# Altium schematic sheet PowerSupply.SchDoc
size 330 x 254 mm; Author: David Arancibia González; CompanyName: Universidad de Santiago de Chile; Address1: Avenida Ecuador Nº 3519; Address2: Estación Central, Santiago; Address3: Chile; DocumentNumber: 2; SheetNumber: 2; SheetTotal: 3
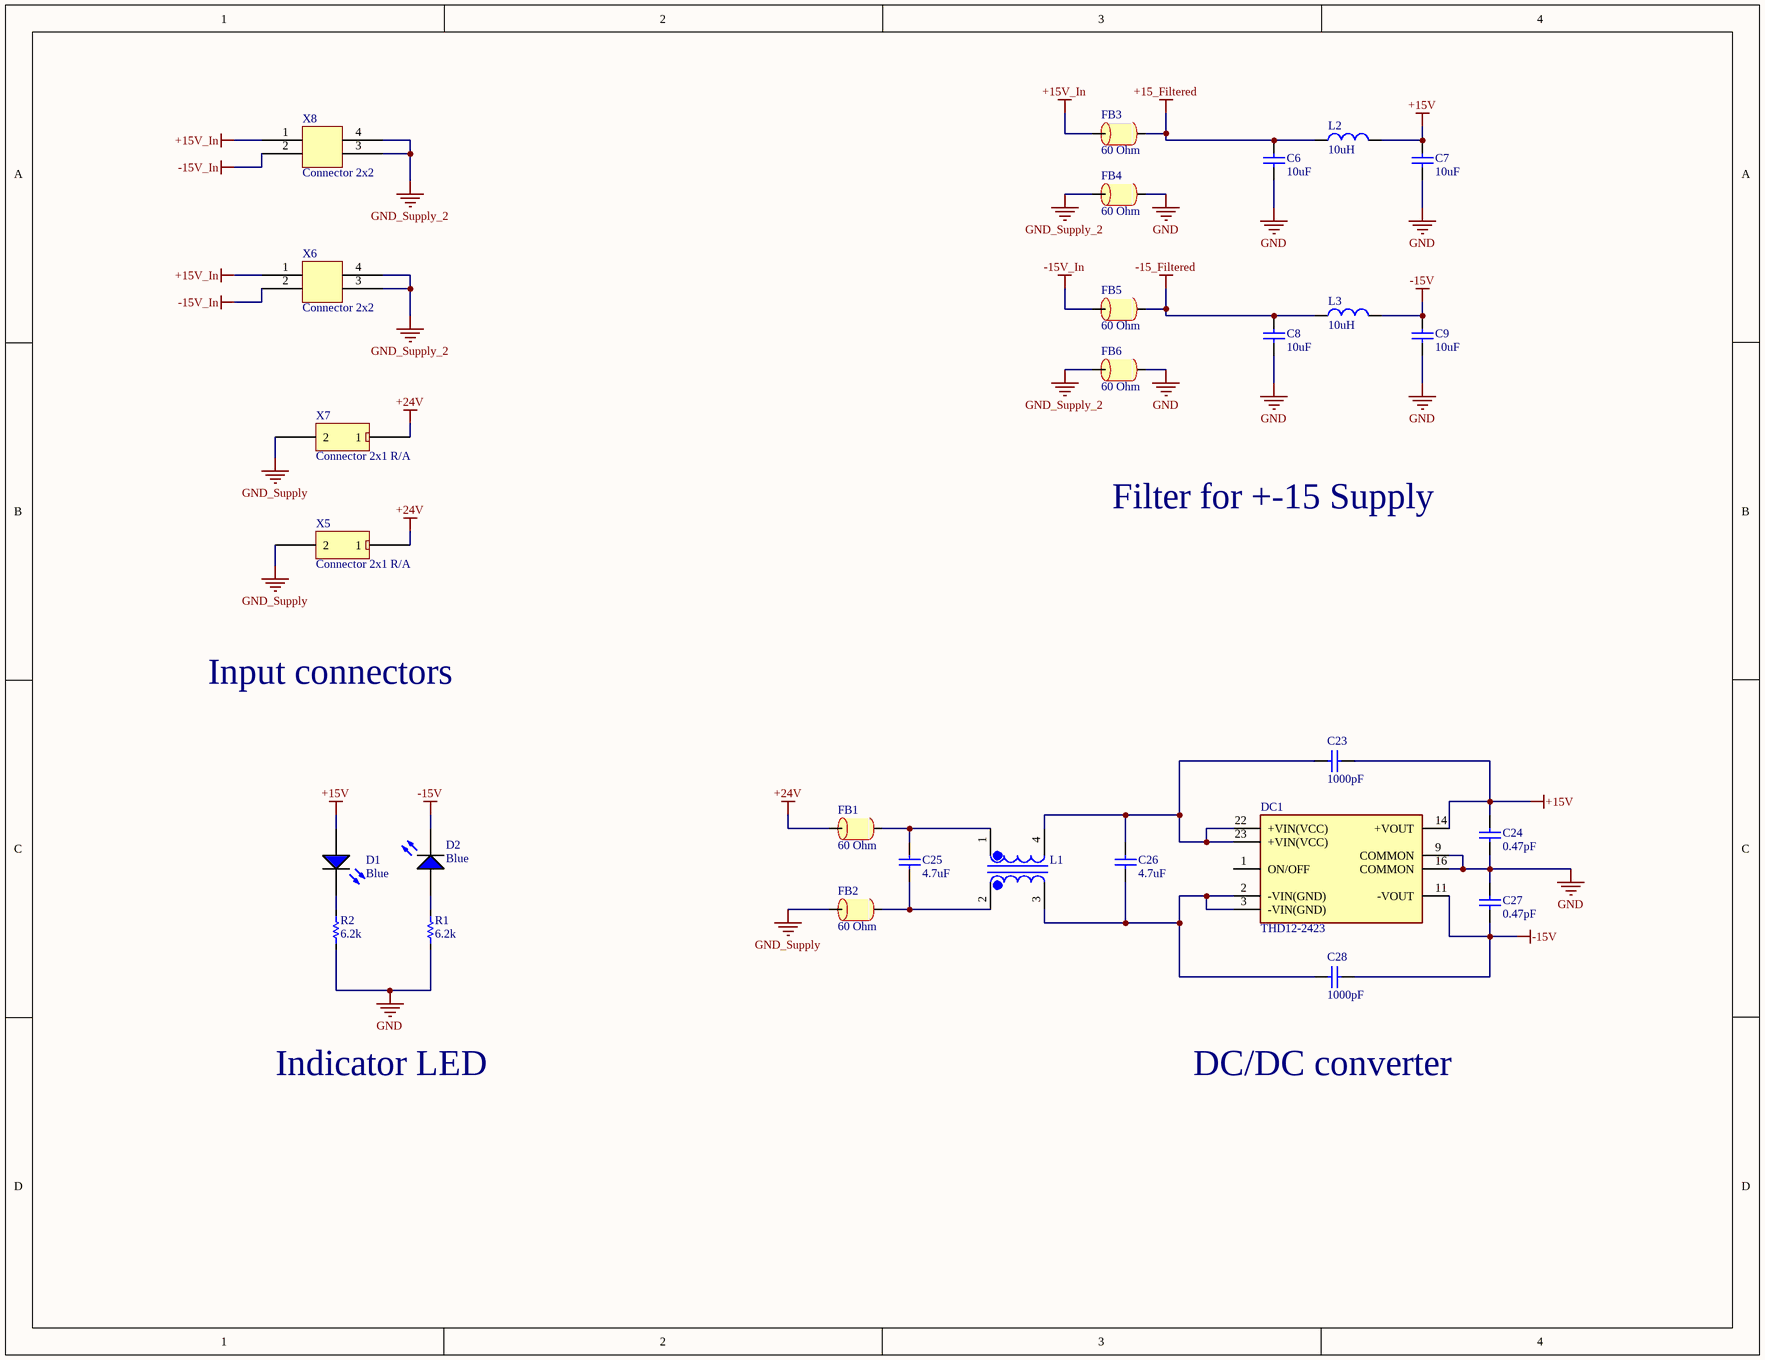
[diagram p0: PowerSupply.SchDoc]

## Parts
C6  10uF  [CAP_1210]
C7  10uF  [CAP_1210]
C8  10uF  [CAP_1210]
C9  10uF  [CAP_1210]
C23  1000pF  [CAP_1206]
C24  0.47pF  [CAP_0603]
C25  4.7uF  [CAP_1206]
C26  4.7uF  [CAP_1206]
C27  0.47pF  [CAP_0603]
C28  1000pF  [CAP_1206]
D1  Blue  [LED_0603_Blue]
D2  Blue  [LED_0603_Blue]
DC1  THD12-2423  [THD 12-2423]
FB1  60 Ohm  [FB_1206]
FB2  60 Ohm  [FB_1206]
FB3  60 Ohm  [FB_1206]
FB4  60 Ohm  [FB_1206]
FB5  60 Ohm  [FB_1206]
FB6  60 Ohm  [FB_1206]
L1  SC-07-04GJ  [SC-07-04GJ]  (value not drawn)
L2  10uH  [INDUCTOR_1210]
L3  10uH  [INDUCTOR_1210]
R1  6.2k  [RES_0603]
R2  6.2k  [RES_0603]
X5  Connector 2x1 R/A  [CON_WR-MPC4-649002227222]
X6  Connector 2x2  [0874270402]
X7  Connector 2x1 R/A  [CON_WR-MPC4-649002227222]
X8  Connector 2x2  [0874270402]

## Nets
+15_Filtered: C6.1 FB3.2 L2.1
+15V: C7.1 C23.2 C24.1 D1.1(A) DC1.14(+VOUT) L2.2
+15V_In: FB3.1 X6.1 X8.1
+24V: FB1.1 X5.1 X7.1
-15_Filtered: C8.1 FB5.2 L3.1
-15V: C9.1 C27.2 C28.2 D2.2(K) DC1.11(-VOUT) L3.2
-15V_In: FB5.1 X6.2 X8.2
GND: C6.2 C7.2 C8.2 C9.2 C24.2 C27.1 DC1.9(COMMON) DC1.16(COMMON) FB4.2 FB6.2 R1.1 R2.1
GND_Supply: FB2.1 X5.2 X7.2
GND_Supply_2: FB4.1 FB6.1 X6.3 X6.4 X8.3 X8.4
NetC23_1: C23.1 C26.1 DC1.22(+VIN(VCC)) DC1.23(+VIN(VCC)) L1.4
NetC25_1: C25.1 FB1.2 L1.1
NetC25_2: C25.2 FB2.2 L1.2
NetC26_2: C26.2 C28.1 DC1.2(-VIN(GND)) DC1.3(-VIN(GND)) L1.3
NetD1_2: D1.2(K) R2.2
NetD2_1: D2.1(A) R1.2

Not connected (* = marked no-connect by the designer): DC1 1(ON/OFF)

## Notes on the sheet
- Filter for +-15 Supply
- Input connectors
- Indicator LED
- DC/DC converter
- Title
- Size:
- Date:
- A4
- Revision:
- Time:
- Sheet
- of
- Author:
- Project:

## Library data of the parts
C6-C9 = Cap_1210: 10µF ±10% 50V Ceramic Capacitor X7R 1210 (3225 Metric); MF: KEMET; MFP: C1210C106K5RACTU; Created: 2020_06_15_DAarancibia; Package: 1210; Value: 10uF; Supplier 1: Digi-Key; Supplier Part Number 1: 399-11629-1-ND
C23 C28 = C1206C102KGRACAUTO: Cap Ceramic 0.001uF 2000V X7R 10% SMD 1206 125°C Embossed Plastic T/R; Manufacturer: KEMET; Voltage Rating: 2kV; Capacitance: 1nF; Supplier 1: Digi-Key; Supplier Part Number 1: 399-12976-1-ND; Manufacturer Part Number: C1206C102KGRACAUTO; RoHS: No; Category: Ceramic Capacitors; Stock 1: 904; Pricing 1: 1=0,27000, 10=0,18500, 50=0,12360, 100=0,10510, 500=0,07418, 1000=0,06491 (USD); Mount: Surface Mount; Case/Package: 1206; Case Code (Metric): 3216; Case Code (Imperial): 1206; Contact Plating: Tin,Matte; Dielectric Material: Ceramic; Min Operating Temperature: -55°C; Max Operating Temperature: 125°C; Tolerance: 10%; Packaging: Tape and Reel; Dielectric: X7R; Termination: SMD/SMT; Voltage Rating (DC): 2kV; Series: C; Construction: Flat; Length: 0.126inch; Width: 0.063inch; Thickness: 0.069inch; Ratings: AEC-Q200; REACH SVHC: No SVHC; RoHS Compliant: No; ComponentLink1URL: http://www.farnell.com/datasheets/2741171.pdf?src-supplier=Farnell; ComponentLink1Description: http://www.farnell.com/datasheets/2741171.pdf?src-supplier=Farnell; ComponentLink2URL: http://www.mouser.com/ds/2/212/KEM_C1010_X7R_HV_SMD-1102742.pdf?src-supplier=Mouser; ComponentLink2Description: http://www.mouser.com/ds/2/212/KEM_C1010_X7R_HV_SMD-1102742.pdf?src-supplier=Mouser; ComponentLink3URL: http://capacitoredge.kemet.com/capedge2/DataSheet/Datasheet-C1206C102KGRACAUTO.pdf?pn=C1206C102KGRACAUTO&src-supplier=Avnet; ComponentLink3Description: http://capacitoredge.kemet.com/capedge2/DataSheet/Datasheet-C1206C102KGRACAUTO.pdf?pn=C1206C102KGRACAUTO&src-supplier=Avnet; ComponentLink4URL: http://www.farnell.com/datasheets/2741171.pdf?src-supplier=Element14; ComponentLink4Description: http://www.farnell.com/datasheets/2741171.pdf?src-supplier=Element14; ComponentLink5URL: https://api.kemet.com/component-edge/download/datasheet/C1206C102KGRACAUTO.pdf?src-supplier=Digi-Key; ComponentLink5Description: https://api.kemet.com/component-edge/download/datasheet/C1206C102KGRACAUTO.pdf?src-supplier=Digi-Key; ComponentLink6URL: http://www.farnell.com/datasheets/2741171.pdf?src-supplier=Newark; ComponentLink6Description: http://www.farnell.com/datasheets/2741171.pdf?src-supplier=Newark
C24 C27 = CC0603CRNPO9BNR47: Surface Mount Ceramic Multilayer Capacitor 0.47pF 0.25pF C0G 50V 0603 Paper T/R; Manufacturer: Yageo; Insulation Resistance: 100GR; Supplier 1: Digi-Key; Supplier Part Number 1: 13-CC0603CRNPO9BNR47CT-ND; Manufacturer Part Number: CC0603CRNPO9BNR47; RoHS: Yes; Category: Ceramic Capacitors; Stock 1: 832; Pricing 1: 1=0,10000, 10=0,05600, 50=0,03040, 100=0,02480, 500=0,01774, 1000=0,01395 (USD); Mount: Surface Mount; Case/Package: 0603; Case Code (Imperial): 0603; Case Code (Metric): 1608; Dielectric Material: Ceramic; Min Operating Temperature: -55°C; Max Operating Temperature: 125°C; Capacitance: 0.47pF; Dielectric: C0G; Package Quantity: 4000; Packaging: Tape and Reel; Voltage Rating: 50V; Voltage Rating (DC): 50V; Termination: SMD/SMT; Resistor Type: Ceramic; Series: CC; Length: 1.6mm; Width: 0.031inch; Height: 0.8mm; Thickness: 0.035inch; Depth: 0.8mm; REACH SVHC: Unknown; Lead Free: Lead Free; RoHS Compliant: Yes; ComponentLink1URL: https://datasheet.ciiva.com/11586/upy-gp-np0-16v-to-50v-8-11586447.pdf?src-supplier=Avnet; ComponentLink1Description: https://datasheet.ciiva.com/11586/upy-gp-np0-16v-to-50v-8-11586447.pdf?src-supplier=Avnet; ComponentLink2URL: https://datasheet.ciiva.com/8033/1443161-8033695.pdf?src-supplier=Element14; ComponentLink2Description: https://datasheet.ciiva.com/8033/1443161-8033695.pdf?src-supplier=Element14; ComponentLink3URL: https://datasheet.ciiva.com/17437/upy-gp-np0-16v-to-50v-8-17437099.pdf?src-supplier=Avnet+Europe; ComponentLink3Description: https://datasheet.ciiva.com/17437/upy-gp-np0-16v-to-50v-8-17437099.pdf?src-supplier=Avnet+Europe
C25 C26 = UMK316ABJ475MLHT: Cap Ceramic 4.7uF 50V X5R 20% Pad SMD 1206 85C Low ESR Automotive T/R; Manufacturer: Taiyo Yuden; Supplier 1: Digi-Key; Supplier Part Number 1: 587-6377-1-ND; Manufacturer Part Number: UMK316ABJ475MLHT; RoHS: Yes; Category: Ceramic Capacitors; Stock 1: 157; Pricing 1: 1=0,41000, 10=0,28400, 50=0,19880, 100=0,17040, 500=0,12782, 1000=0,10794 (USD); Mount: Surface Mount; Case/Package: 1206; Min Operating Temperature: -55°C; Max Operating Temperature: 85°C; Packaging: Tape and Reel; Capacitance: 4.7uF; Tolerance: 20%; Voltage Rating: 50V; Ratings: AEC-Q200; RoHS Compliant: Yes; ComponentLink1URL: https://www.yuden.co.jp/productdata/catalog/mlcc_all_hq_e.pdf?src-supplier=Digi-Key; ComponentLink1Description: https://www.yuden.co.jp/productdata/catalog/mlcc_all_hq_e.pdf?src-supplier=Digi-Key
D1 D2 = Led_0603_Blue: Blue 470nm LED Indication - Discrete 3.2V 0603 (1608 Metric); MF: Würth Elektronik; MFP: 150060BS75000; Created: 2020_07_06_DAarancibia; Package: 0603; Value: Blue; Supplier 1: Digi-Key; Supplier Part Number 1: 732-4966-1-ND
DC1 = THD12-2423: TRACOPOWER Isolated DC-DC Converter, Vin 18  36 V dc, Vout 15V dc, I/O isolation 1500V dc; Max Input Voltage: 36V; Min Input Voltage: 18V; Number of Outputs: 2; Output Current: 400mA; Nominal Input Voltage: 24V; Max Output Power: 12W; Isolation Voltage: 1.5kV; Efficiency: 88%; Voltage - Output 2: -15V; Supplier 1: Digi-Key; Supplier Part Number 1: 1951-2256-ND; Manufacturer: Traco Power; Manufacturer Part Number: THD12-2423; RoHS: Yes; Category: Board Mount Modules; Stock 1: 196; Pricing 1: 1=41,27000, 10=38,22000, 25=37,62280, 40=35,83125, 80=32,84525, 230=32,24813, 440=31,85000 (USD); Mount: Through Hole; Case/Package: PDIP; Number of Pins: 9; Min Operating Temperature: -40°C; Max Operating Temperature: 85°C; Output Voltage: 15V; Min Input Voltage (DC): 18V; Voltage - Output 1: 15V; Current - Output 1: 400mA; Max Input Voltage (DC): 36V; Isolation: Isolated; Current - Output 2: 400mA; Length: 31.8mm; Depth: 20.3mm; REACH SVHC: No SVHC; RoHS Compliant: Yes; ComponentLink1URL: https://datasheet.ciiva.com/29185/154654-da-01-de-dc-dc-wandler-12w-thd-12-2423-29185432.pdf?src-supplier=Conrad; ComponentLink1Description: https://datasheet.ciiva.com/29185/154654-da-01-de-dc-dc-wandler-12w-thd-12-2423-29185432.pdf?src-supplier=Conrad; ComponentLink2URL: https://datasheet.ciiva.com/46416/1858119-46416695.pdf?src-supplier=Element14; ComponentLink2Description: https://datasheet.ciiva.com/46416/1858119-46416695.pdf?src-supplier=Element14
FB1-FB6 = Ferrite Bead: 60 Ohms @ 100MHz 1 Power Line Ferrite Bead 1206 (3216 Metric) 4A 10mOhm; MF: Taiyo Yuden; MFP: FBMJ3216HM600-T; Created: 2020_07_06_DAarancibia; Package: 1206; Value: 60 Ohm; Supplier 1: Digi-Key; Supplier Part Number 1: 587-1770-1-ND
L1 = SC-07-04GJ: Ind Common Mode Choke 0.36mH 7A 14m Ohm Toroid 4-Pin Radial Tray; Manufacturer: KEMET; Supplier 1: Digi-Key; Supplier Part Number 1: 399-SC-07-04GJ-ND; Manufacturer Part Number: SC-07-04GJ; RoHS: Yes; Category: Common Mode Chokes; Stock 1: 286; Pricing 1: 1=3,59000, 10=3,29500, 25=2,99520, 60=2,51583, 120=2,15650, 240=2,03667, 480=1,91688, 960=1,79707, 2400=1,73717 (USD); RoHS Compliant: Yes
L2 L3 = Inductor_1210: 10µH Unshielded Wirewound Inductor 700mA 350mOhm Max 1210 (3225 Metric); MF: Taiyo Yuden; MFP: BRL3225T100M; Created: 2020_07_06_DAarancibia; Package: 1210; Value: 10uH; Supplier 1: Digi-Key; Supplier Part Number 1: 587-5505-1-ND
R1 R2 = Res_0603: 10 kOhms ±1% 0.1W, 1/10W Chip Resistor 0402 (1005 Metric) Anti-Sulfur, Automotive AEC-Q200 Thick Film; MF: Panasonic Electronic Components; MFP: ERJ-3EKF6201V; Created: 2020_06_15_DAarancibia; Package: 0603; Value: 6.2k; Supplier 1: Digi-Key; Supplier Part Number 1: P6.20KHCT-ND
X5 X7 = Con_WR-MPC4_2x1: Connector Header Through Hole, Right Angle 2 position 0.165" (4.20mm); MPN: 649002227222; MF: Würth Elektronik; Created: 2020_06_14_DArancibia; Package: Through Hole, pitch 0.165" (4.20mm); Value: Connector 2x1 R/A; Supplier 1: Digi-Key; Supplier Part Number 1: 732-1937-ND
X6 X8 = 0874270402: Conn Power HDR 4 POS 4.2mm Solder RA Thru-Hole 4 Terminal 1 Port Mini-Fit Jr™ Frame; Manufacturer: Molex; Number of Terminals/Pins: 4; Connector Type: Male Pin; Number of Ports: 1; Pitch: 0.165inch; Supplier 1: Digi-Key; Supplier Part Number 1: WM4464-ND; Manufacturer Part Number: 0874270402; RoHS: Yes; Category: Headers and Wire Housings; Stock 1: 50392; Pricing 1: 1=1,32000, 10=1,09400, 80=0,91200, 1740=0,68402, 5220=0,63842, 10440=0,60650 (USD); Mount: Through Hole; Color: Beige; Contact Material: Brass; Contact Plating: Tin; Housing Material: Nylon; Min Operating Temperature: -40°C; Max Operating Temperature: 105°C; Number of Rows: 2; Packaging: Tray; Number of Positions: 4; Termination: Solder; Number of Contacts: 4; Orientation: Right Angle; Series: Mini-Fit® Jr™ 87427; Fastening Type: Ramp; Contact Type: Male Pin; Length: 10.8mm; Row Spacing: 0.165inch; Depth: 19.4mm; RoHS Compliant: Yes; ComponentLink1URL: https://datasheet.ciiva.com/737/874270802-sd-737977.pdf?src-supplier=Digi-Key; ComponentLink1Description: https://datasheet.ciiva.com/737/874270802-sd-737977.pdf?src-supplier=Digi-Key